# EAGLE board BMSV1.1 (EAGLE 9.2.2), part 1 of 2
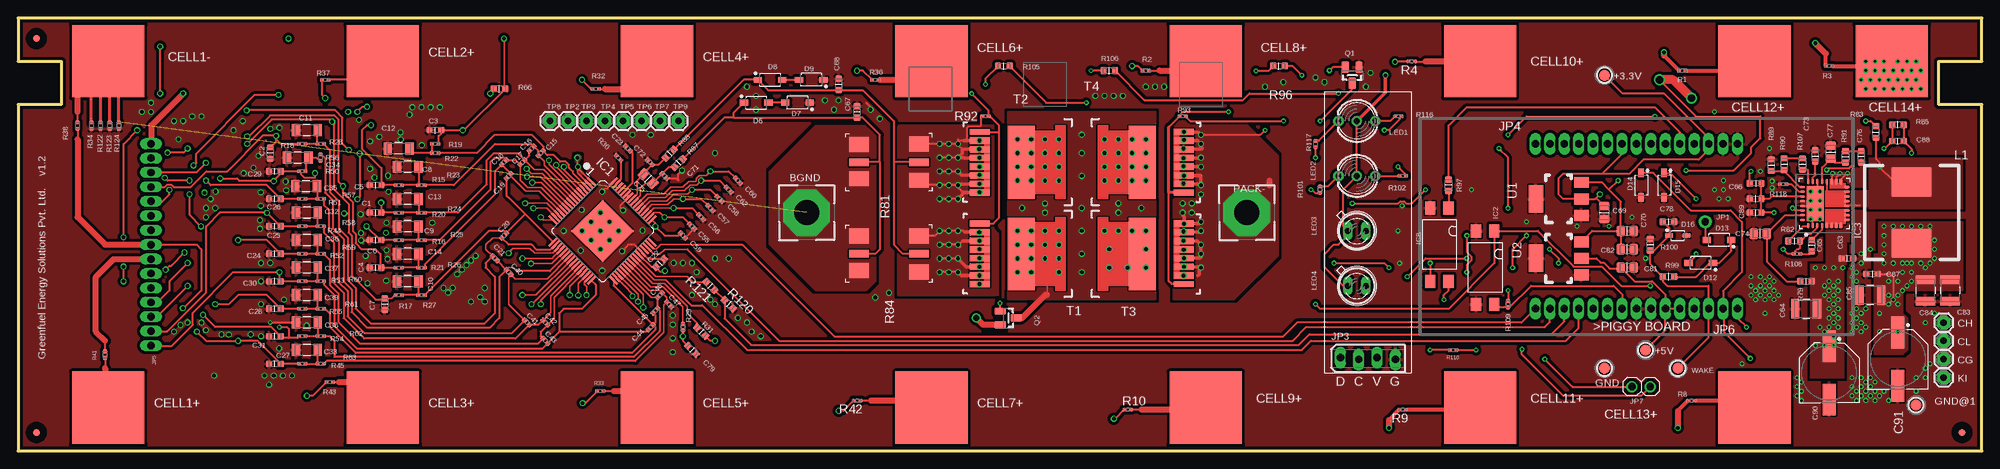
[diagram p3: board, top side]
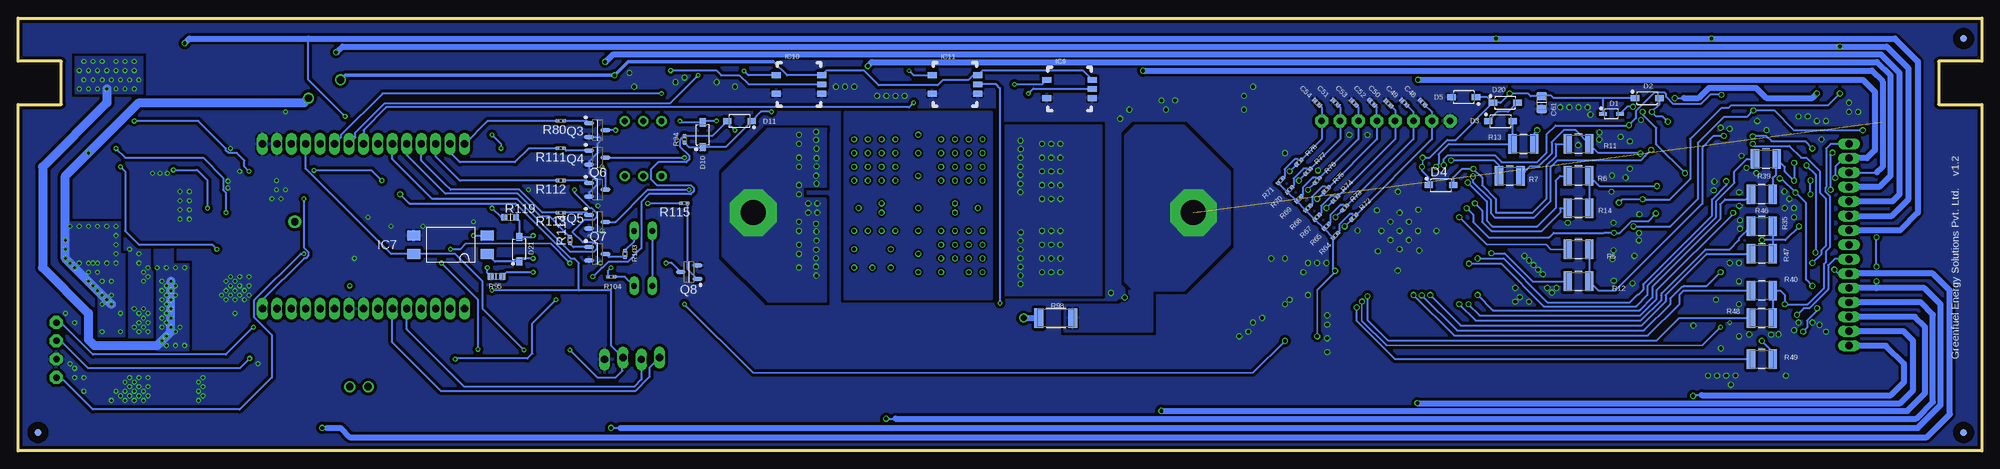
[diagram p4: board, bottom side, seen from below]

Size 272 x 60 mm. Coordinates in mm from the lower left corner, seen from the top.
Outline: 0,0 272,0 272,48 266,48 266,54 272,54 272,60 0,60 0,54 6,54 6,48 0,48 0,0
Copper layers (1*16): Top 0.035mm / dielectric 1.5mm / Bottom 0.035mm
Design rules "SeeedStudio_2layer_DRU_no_angle_20140221 *": minimum track width 6mil, minimum drill 12mil, track to track 10mil, track to pad 8mil, pad to pad 6mil, via to via 10mil, smd to smd 0mil, copper to edge 10mil, drill to drill 10mil, minimum pad ring 10mil, minimum via ring 6mil, stop-mask expansion 2mil, vias tented up to drill 100mil, thermal gap 10mil

## Footprints (pad centres in the part's own frame; a part is rotated, then mirrored left to right if it is on the bottom)
TP-SMD60 = smd 1.524 x 1.524: P$1 0,0
WPAD = drill 3.5 pad 6.452 octagon: 1 0,0
CAPC1608X92N = smd 0.9 x 0.95: 1 -0.8,0; 2 0.8,0
CAPC3215X168N = smd 1.15 x 1.65: 1 -1.5,0; 2 1.5,0
CAPC1005X60N = smd 0.65 x 0.65: 1 -0.45,0; 2 0.45,0
CAPC2012X145AN = smd 1.15 x 1.45: 1 -0.9,0; 2 0.9,0
CAPC3225X168N = smd 1.15 x 2.7: 1 -1.5,0; 2 1.5,0
CAPAE830X1020N = smd 4.4 x 1.8: + -3.7,0; - 3.7,0
CELL_PAD = smd 10 x 10: P$1 0,0
TP7035 = drill 0.9 pad 1.778 octagon: P$1 0,0
SOD2514X100N = smd 1.05 x 0.5: A 1.2,0; K -1.2,0
SOD3718X135N = smd 1.15 x 0.8: A 1.7,0; K -1.7,0
FIDUCIAL_1MM = smd 1 x 1: 1 0,0
64PIN-LQFP = smd 1.55 x 0.3: 1 -5.93,3.75; 2 -5.93,3.25; 3 -5.93,2.75; 4 -5.93,2.25; 5 -5.93,1.75; 6 -5.93,1.25; 7 -5.93,0.75; 8 -5.93,0.25; 9 -5.93,-0.25; 10 -5.93,-0.75; 11 -5.93,-1.25; 12 -5.93,-1.75; 13 -5.93,-2.25; 14 -5.93,-2.75; 15 -5.93,-3.25; 16 -5.93,-3.75; 33 5.93,-3.75; 34 5.93,-3.25; 35 5.93,-2.75; 36 5.93,-2.25; 37 5.93,-1.75; 38 5.93,-1.25; 39 5.93,-0.75; 40 5.93,-0.25; 41 5.93,0.25; 42 5.93,0.75; 43 5.93,1.25; 44 5.93,1.75; 45 5.93,2.25; 46 5.93,2.75; 47 5.93,3.25; 48 5.93,3.75 | smd 0.3 x 1.55: 17 -3.75,-5.93; 18 -3.25,-5.93; 19 -2.75,-5.93; 20 -2.25,-5.93; 21 -1.75,-5.93; 22 -1.25,-5.93; 23 -0.75,-5.93; 24 -0.25,-5.93; 25 0.25,-5.93; 26 0.75,-5.93; 27 1.25,-5.93; 28 1.75,-5.93; 29 2.25,-5.93; 30 2.75,-5.93; 31 3.25,-5.93; 32 3.75,-5.93; 49 3.75,5.93; 50 3.25,5.93; 51 2.75,5.93; 52 2.25,5.93; 53 1.75,5.93; 54 1.25,5.93; 55 0.75,5.963; 56 0.25,5.93; 57 -0.25,5.93; 58 -0.75,5.93; 59 -1.25,5.93; 60 -1.75,5.93; 61 -2.25,5.93; 62 -2.75,5.93; 63 -3.25,5.93; 64 -3.75,5.93 | smd 6.1 x 6.1: 65 0,0
SFH = smd 1.4 x 1.8: 1 1.27,5.08; 2 -1.27,5.08; 3 -1.27,-5.08; 4 1.27,-5.08
VQFN-32 = smd 0.75 x 0.35: 1 -3.05,2.275; 2 -3.05,1.625; 3 -3.05,0.975; 4 -3.05,0.325; 5 -3.05,-0.325; 6 -3.05,-0.975; 7 -3.05,-1.625; 8 -3.05,-2.275; 17 3.05,-2.275; 18 3.05,-1.625; 19 3.05,-0.975; 20 3.05,-0.325; 21 3.05,0.325; 22 3.05,0.975; 23 3.05,1.625; 24 3.05,2.275 | smd 0.35 x 0.75: 9 -2.275,-3.05; 10 -1.625,-3.05; 11 -0.975,-3.05; 12 -0.325,-3.05; 13 0.325,-3.05; 14 0.975,-3.05; 15 1.625,-3.05; 16 2.275,-3.05; 25 2.275,3.05; 26 1.625,3.05; 27 0.975,3.05; 28 0.325,3.05; 29 -0.325,3.05; 30 -0.975,3.05; 31 -1.625,3.05; 32 -2.275,3.05 | smd 4.85 x 2.36: 33 0,1.27
SO6-5PIN = smd 0.8 x 1.2: 1 -1.27,-3.15; 3 1.27,-3.15; 4 1.27,3.15; 5 0,3.15; 6 -1.27,3.15
1X01-CLEANBIG = drill 1.016 pad 1.778: 1 0,0
OLED-CON = drill 1.016 long: 1 0,0.127; 2 2.54,-0.127; 3 5.08,0.127; 4 7.62,-0.127
1X15 = drill 1.016 long: 1 -14,0; 2 -12,0; 3 -10,0; 4 -8,0; 5 -6,0; 6 -4,0; 7 -2,0; 8 0,0; 9 2,0; 10 4,0; 11 6,0; 12 8,0; 13 10,0; 14 12,0; 15 14,0
1X02 = drill 1.016: 1 -2.54,0; 2 0,0
MSS1278D/T = smd 5.5 x 4: 1 0,4.25; 2 0,-4.25
L-59EGW-CA = drill 0.8 pad 1.4: 1 0,2.54; 2 0,0; 3 0,-2.54
SFH482 = drill 0.813 long: A -1.27,0; K 1.27,0
SOT23-3 = smd 1 x 1.6: 1 -0.95,-1.1; 2 0.95,-1.1; 3 0,1.1
SOT95P280X135-3N = smd 1.4 x 0.65: 1 -1.15,0.95; 2 -1.15,-0.95; 3 1.15,0
RESC1005X40AN = smd 0.6 x 0.6: 1 -0.45,0; 2 0.45,0
RESC3225X70N = smd 1.15 x 2.7: 1 -1.5,0; 2 1.5,0
RESC1608X55N = smd 0.9 x 1: 1 -0.8,0; 2 0.8,0
SMD4 = smd 2.7 x 2.066: 1 -4.15,2.5; 3 -4.15,-2.5; 4 4.15,-2.45; 6 4.15,2.3 | smd 2.7 x 1.033: 2 -4.15,0; 5 4.15,0
RESC5025X70N = smd 1.25 x 2.7: 1 -2.35,0; 2 2.35,0
PG-HSOF-9 = smd 0.8 x 2.8: 1 -4.2,-5.25; 2 -3,-5.25; 3 -1.8,-5.25; 4 -0.6,-5.25; 5 0.6,-5.25; 6 1.8,-5.25; 7 3,-5.25; 8 4.2,-5.25 | smd 10 x 3.7: 9 0,0.5
SOT-223 = smd 1.5 x 2: 1 -2.3,-3.15; 2 0,-3.15; 3 2.3,-3.15 | smd 3.8 x 2: 4 0,3.15

## Placement (x,y rotation side)
+3.3V  TP-SMD60  [TP-SMD60]  219.71,52.07 0 top
+5V  TP-SMD60  [TP-SMD60]  225.43,13.97 0 top
BGND  [WPAD]  109.22,33.02 0 top
C1  0.047uF  [CAPC1608X92N]  49.53,33.02 180 top
C2  0.047uF  [CAPC1608X92N]  34.92,41.27 270 top
C3  0.047uF  [CAPC1608X92N]  57.79,44.45 180 top
C4  0.047uF  [CAPC1608X92N]  49.53,25.4 180 top
C5  0.047uF  [CAPC1608X92N]  49.53,36.83 180 top
C6  0.047uF  [CAPC1608X92N]  49.53,29.21 180 top
C7  0.047uF  [CAPC1608X92N]  50.8,20.32 270 top
C8  0.47uF  [CAPC3215X168N]  53.98,39.37 180 top
C9  0.47uF  [CAPC3215X168N]  53.98,31.11 180 top
C10  0.47uF  [CAPC3215X168N]  53.98,23.5 180 top
C11  0.47uF  [CAPC3215X168N]  40,44.45 180 top
C12  0.47uF  [CAPC3215X168N]  52.71,41.91 180 top
C13  0.47uF  [CAPC3215X168N]  53.97,34.91 180 top
C14  0.47uF  [CAPC3215X168N]  53.98,27.3 180 top
C15  0.047uF  [CAPC1005X60N]  72.39,41.27 225 top
C16  0.047uF  [CAPC1005X60N]  71.12,41.91 225 top
C17  0.047uF  [CAPC1005X60N]  69.85,40.01 225 top
C18  0.047uF  [CAPC1005X60N]  67.31,40.01 225 top
C19  0.047uF  [CAPC1005X60N]  67.94,38.1 225 top
C20  0.047uF  [CAPC1005X60N]  67.31,29.84 225 top
C21  0.047uF  [CAPC1005X60N]  66.04,26.67 315 top
C22  2.2uF  [CAPC1608X92N]  88.9,26.03 45 top
C23  .047uF  [CAPC1005X60N]  84.45,41.91 135 top
C24  0.047uF  [CAPC1608X92N]  35.56,27.3 180 top
C25  0.047uF  [CAPC1608X92N]  35.56,31.11 180 top
C26  0.047uF  [CAPC1608X92N]  35.56,34.93 180 top
C27  0.047uF  [CAPC1608X92N]  35.56,12.06 180 top
C28  0.047uF  [CAPC1608X92N]  35.56,19.69 180 top
C29  0.047uF  [CAPC1608X92N]  35.56,38.73 180 top
C30  0.047uF  [CAPC1608X92N]  35.56,23.48 180 top
C31  0.047uF  [CAPC1608X92N]  35.56,15.88 180 top
C32  0.47uF  [CAPC3215X168N]  40.01,33.02 180 top
C33  0.47uF  [CAPC3215X168N]  40.01,13.97 180 top
C34  0.47uF  [CAPC3215X168N]  38.73,40.64 180 top
C35  0.47uF  [CAPC3215X168N]  39.89,36.68 180 top
C36  0.47uF  [CAPC3215X168N]  40.01,29.2 180 top
C37  0.47uF  [CAPC3215X168N]  40.01,25.4 180 top
C38  0.47uF  [CAPC3215X168N]  40.01,17.78 180 top
C39  0.47uF  [CAPC3215X168N]  39.99,21.6 180 top
C40  0.047uF  [CAPC1005X60N]  67.94,24.77 315 top
C41  0.047uF  [CAPC1005X60N]  70.48,17.78 315 top
C42  0.047uF  [CAPC1005X60N]  73.03,17.78 315 top
C43  0.047uF  [CAPC1005X60N]  73.03,15.24 315 top
C44  0.047uF  [CAPC1005X60N]  87.63,17.14 45 top
C45  0.047uF  [CAPC1005X60N]  88.27,19.43 45 top
C46  0.047uF  [CAPC1005X60N]  88.9,21.59 45 top
C47  0.047uF  [CAPC1005X60N]  90.17,20.32 315 top
C48  2200pF  [CAPC1005X60N]  77.47,48.26 135 bottom
C49  2200pF  [CAPC1005X60N]  80.01,48.26 135 bottom
C50  2200pF  [CAPC1005X60N]  82.2,48.15 135 bottom
C51  2200pF  [CAPC1005X60N]  89.53,48.26 135 bottom
C52  2200pF  [CAPC1005X60N]  84.46,48.26 135 bottom
C53  2200pF  [CAPC1005X60N]  87,48.26 135 bottom
C54  2200pF  [CAPC1005X60N]  92.08,48.26 135 bottom
C55  1000pF  [CAPC1005X60N]  93.34,31.11 315 top
C56  1000pF  [CAPC1005X60N]  94.61,32.38 315 top
C57  1000pF  [CAPC1005X60N]  95.89,33.66 315 top
C58  1000pF  [CAPC1005X60N]  97.16,34.92 315 top
C59  1000pF  [CAPC1005X60N]  92.08,29.84 315 top
C60  1000pF  [CAPC1005X60N]  99.69,37.47 315 top
C61  0.22uF  [CAPC2012X145AN]  60.96,48.26 270 bottom
C62  1000pF  [CAPC1005X60N]  98.42,36.2 315 top
C63  0.1uF 100V  [CAPC1608X92N]  253.37,26.67 180 top
C64  2.2uF 100V  [CAPC3225X168N]  247.65,19.68 0 top
C65  0.1uF 100V  [CAPC1608X92N]  248.41,28.45 270 top
C66  0.1uF 100V  [CAPC1608X92N]  240.67,37.08 0 top
C67  47nF  [CAPC1608X92N]  116.2,46.99 90 top
C68  47nF  [CAPC1608X92N]  113.67,50.8 90 top
C69  10uF  [CAPC2012X145AN]  219.71,33.02 90 top
C70  10uF  [CAPC2012X145AN]  222.88,30.48 180 top
C71  47nF  [CAPC1005X60N]  89.53,38.1 315 top
C72  47nF  [CAPC1005X60N]  87.5,40.01 135 top
C73  2.2uF 16V  [CAPC1608X92N]  248.92,40.89 90 top
C74  1uF 100V  [CAPC2012X145AN]  241.31,30.1 180 top
C75  6.8uF  [CAPC2012X145AN]  87.27,37.73 135 top
C76  2.2uF  [CAPC1608X92N]  255.28,40.76 270 top
C77  4.7uF  [CAPC2012X145AN]  251.08,41.41 90 top
C78  0.1uF  [CAPC1608X92N]  228.6,31.75 180 top
C79  0.1uF  [CAPC1608X92N]  93.34,13.97 315 top
C81  10uF  [CAPC2012X145AN]  222.88,25.4 180 top
C82  10uF  [CAPC2012X145AN]  222.88,27.94 180 top
C83  47uF 16V  [CAPC3225X168N]  267.59,22.23 270 top
C84  47uF 16V  [CAPC3225X168N]  264.16,22.23 270 top
C85  47uF 16V  [CAPC3225X168N]  256.54,21.59 180 top
C87  0.1uF 16V  [CAPC1608X92N]  256.79,24.51 0 top
C88  4700pF 50V  [CAPC1608X92N]  260.35,42.93 180 top
C89  10pF 50V  [CAPC1608X92N]  240.66,33.02 180 top
C90  39uF 100V  [CAPAE830X1020N]  250.82,10.79 270 top
C91  330uF 25V  [CAPAE830X1020N]  260.35,12.7 270 top
CELL1+  GF_BMS_CELL_PADP_PAD  [CELL_PAD]  12.5,6 0 top
CELL1-  GF_BMS_CELL_PADP_PAD  [CELL_PAD]  12.5,54 0 top
CELL2+  GF_BMS_CELL_PADP_PAD  [CELL_PAD]  50.5,54 0 top
CELL3+  GF_BMS_CELL_PADP_PAD  [CELL_PAD]  50.5,6 0 top
CELL4+  GF_BMS_CELL_PADP_PAD  [CELL_PAD]  88.5,54 0 top
CELL5+  GF_BMS_CELL_PADP_PAD  [CELL_PAD]  88.5,6 0 top
CELL6+  GF_BMS_CELL_PADP_PAD  [CELL_PAD]  126.5,54 0 top
CELL7+  GF_BMS_CELL_PADP_PAD  [CELL_PAD]  126.5,6 0 top
CELL8+  GF_BMS_CELL_PADP_PAD  [CELL_PAD]  164.5,54 0 top
CELL9+  GF_BMS_CELL_PADP_PAD  [CELL_PAD]  164.5,6 0 top
CELL10+  GF_BMS_CELL_PADP_PAD  [CELL_PAD]  202.5,54 0 top
CELL11+  GF_BMS_CELL_PADP_PAD  [CELL_PAD]  202.5,6 0 top
CELL12+  GF_BMS_CELL_PADP_PAD  [CELL_PAD]  240.5,54 0 top
CELL13+  GF_BMS_CELL_PADP_PAD  [CELL_PAD]  240.5,6 0 top
CELL14+  GF_BMS_CELL_PADP_PAD  [CELL_PAD]  259.5,54 0 top
CG  TPTH7035  [TP7035]  266.7,12.7 0 top
CH  TPTH7035  [TP7035]  266.7,17.78 0 top
CL  TPTH7035  [TP7035]  266.7,15.24 0 top
D1  43V  [SOD2514X100N]  51.31,46.74 0 bottom
D2  33V  [SOD3718X135N]  46.35,48.9 0 bottom
D3  8.2V  [SOD3718X135N]  66.67,45.72 0 bottom
D4  20V  [SOD3718X135N]  74.93,36.83 0 bottom
D5  75V  [SOD3718X135N]  71.75,49.02 180 bottom
D6  2v  [SOD3718X135N]  102.22,48.26 0 top
D7  2v  [SOD3718X135N]  107.95,48.26 180 top
D8  2v  [SOD3718X135N]  104.14,51.44 0 top
D9  2v  [SOD3718X135N]  109.86,51.44 180 top
D10  [SOD3718X135N]  177.16,43.81 90 bottom
D11  8.2v  [SOD3718X135N]  172.09,45.72 180 bottom
D12  [SOD3718X135N]  233.04,26.04 180 top
D13  [SOD3718X135N]  235.59,29.21 180 top
D14  [SOD3718X135N]  224.79,36.83 270 top
D15  [SOD3718X135N]  227.97,36.83 270 top
D16  [SOD2514X100N]  229.87,29.84 0 top
D20  8.2V  [SOD3718X135N]  66.04,48.26 0 bottom
D21  8.2V  [SOD3718X135N]  202.56,27.94 90 bottom
FD1  FIDUCIAL  [FIDUCIAL_1MM]  2.54,2.54 0 top
FD2  FIDUCIAL  [FIDUCIAL_1MM]  269.24,2.54 0 top
FD3  FIDUCIAL  [FIDUCIAL_1MM]  2.54,57.15 0 top
FD4  FIDUCIAL  [FIDUCIAL_1MM]  2.54,57.15 0 bottom
FD5  FIDUCIAL  [FIDUCIAL_1MM]  269.24,2.54 0 bottom
FD6  FIDUCIAL  [FIDUCIAL_1MM]  2.54,2.54 0 bottom
GND  TP-SMD60  [TP-SMD60]  219.71,11.43 0 top
GND@1  TP-SMD60  [TP-SMD60]  262.89,6.35 0 top
IC1  MC33771BEP  [64PIN-LQFP]  80.95,30.48 315 top
IC2  SFH6156-1  [SFH]  203.2,25.4 0 top
IC3  MIC28515V1  [VQFN-32]  250.19,34.29 90 top
IC7  SFH6156-1  [SFH]  212.09,28.57 270 bottom
IC8  SFH6156-1  [SFH]  196.85,28.57 0 top
IC9  TLP152-COUPLERTOSHIBA  [SO6-5PIN]  126.36,50.16 270 bottom
IC10  TLP152-COUPLERTOSHIBA  [SO6-5PIN]  163.83,50.8 270 bottom
IC11  TLP152-COUPLERTOSHIBA  [SO6-5PIN]  142.24,50.8 270 bottom
JP1  [1X01-CLEANBIG]  233.68,31.75 0 top
JP3  [OLED-CON]  183.14,12.8 0 top
JP4  [1X15]  224.16,42.55 0 top
JP5  [1X15]  18.41,28.57 90 top
JP6  [1X15]  224.16,19.68 0 top
JP7  [1X02]  226.06,8.89 0 top
KI  TPTH7035  [TP7035]  266.7,10.16 0 top
L1  MSS1278-D  [MSS1278D/T]  262.25,33.02 0 top
LED1  L-59EGW-CAGR  [L-59EGW-CA]  185.42,45.72 90 top
LED2  L-59EGW-CAGR  [L-59EGW-CA]  185.42,38.1 90 top
LED3  SFH48225  [SFH482]  185.42,30.48 0 top
LED4  SFH48225  [SFH482]  185.42,22.86 0 top
PACK-  [WPAD]  170.18,33.02 0 top
Q1  ZXMP10A17G  [SOT23-3]  184.78,52.07 180 top
Q2  SI2392ADS-T1-GE3  [SOT23-3]  137.16,18.41 270 top
Q3  [SOT95P280X135-3N]  191.77,44.45 0 bottom
Q4  [SOT95P280X135-3N]  191.77,40.64 0 bottom
Q5  [SOT95P280X135-3N]  191.77,31.75 0 bottom
Q6  [SOT95P280X135-3N]  191.77,36.2 0 bottom
Q7  [SOT95P280X135-3N]  191.77,27.3 0 bottom
Q8  [SOT95P280X135-3N]  179.07,24.77 180 bottom
R1  0E  [RESC1005X40AN]  230.5,52.7 180 top
R2  0E  [RESC1005X40AN]  156.21,52.7 180 top
R3  0E  [RESC1005X40AN]  250.82,53.34 180 top
R4  0E  [RESC1005X40AN]  193.04,53.98 180 top
R5  39E  [RESC3225X70N]  55.88,27.94 180 bottom
R6  39E  [RESC3225X70N]  55.88,38.1 180 bottom
R7  39E  [RESC3225X70N]  65.41,38.1 180 bottom
R8  0E  [RESC1005X40AN]  231.78,6.99 180 top
R9  0E  [RESC1005X40AN]  191.77,5.71 180 top
R10  0E  [RESC1005X40AN]  153.67,5.71 0 top
R11  39E  [RESC3225X70N]  55.88,42.55 180 bottom
R12  39E  [RESC3225X70N]  55.88,23.5 180 bottom
R13  39E  [RESC3225X70N]  63.5,42.55 0 bottom
R14  39E  [RESC3225X70N]  55.88,33.66 180 bottom
R15  3k  [RESC1005X40AN]  52.71,36.83 0 top
R16  3k  [RESC1005X40AN]  52.7,29.21 0 top
R17  3k  [RESC1005X40AN]  52.7,21.59 0 top
R18  3k  [RESC1005X40AN]  39.37,42.55 0 top
R19  3k  [RESC1005X40AN]  57.79,42.55 180 top
R20  3k  [RESC1005X40AN]  52.7,33.01 0 top
R21  3k  [RESC1005X40AN]  52.7,25.4 0 top
R22  2k  [RESC1005X40AN]  57.78,41.27 0 top
R23  2k  [RESC1005X40AN]  55.88,36.83 0 top
R24  2k  [RESC1005X40AN]  55.88,33.02 0 top
R25  2k  [RESC1005X40AN]  55.88,29.21 0 top
R26  2k  [RESC1005X40AN]  55.88,25.4 0 top
R27  2k  [RESC1005X40AN]  55.88,21.59 0 top
R28  2k  [RESC1005X40AN]  41.91,42.55 0 top
R29  10k  [RESC1005X40AN]  92.08,17.14 270 top
R30  10k  [RESC1005X40AN]  83.19,40.64 135 top
R31  127E  [RESC1608X55N]  94.61,16.51 315 top
R32  0E  [RESC1005X40AN]  80.01,50.16 180 top
R33  0E  [RESC1005X40AN]  80.64,8.26 180 top
R34  0E  [RESC1005X40AN]  10.16,45.09 270 top
R35  39E  [RESC3225X70N]  30.48,31.11 180 bottom
R36  0E  [RESC1005X40AN]  118.75,51.44 180 top
R37  0E  [RESC1005X40AN]  42.55,51.44 180 top
R38  0E  [RESC1005X40AN]  8.26,45.09 270 top
R39  39E  [RESC3225X70N]  29.92,40.46 180 bottom
R40  39E  [RESC3225X70N]  30.48,22.23 180 bottom
R41  0E  [RESC1005X40AN]  12.06,13.34 90 top
R42  0E  [RESC1005X40AN]  116.2,6.99 180 top
R43  0E  [RESC1005X40AN]  43.18,9.53 180 top
R44  3k  [RESC1005X40AN]  39.37,31.11 0 top
R45  3k  [RESC1005X40AN]  39.37,12.06 0 top
R46  39E  [RESC3225X70N]  30.48,35.56 180 bottom
R47  39E  [RESC3225X70N]  30.48,27.3 180 bottom
R48  39E  [RESC3225X70N]  30.48,18.41 180 bottom
R49  39E  [RESC3225X70N]  30.48,12.7 180 bottom
R50  3k  [RESC1005X40AN]  39.37,38.73 0 top
R51  3k  [RESC1005X40AN]  39.37,34.93 0 top
R52  3k  [RESC1005X40AN]  39.37,27.3 0 top
R53  3k  [RESC1005X40AN]  39.37,23.5 0 top
R54  3k  [RESC1005X40AN]  39.37,15.88 0 top
R55  3k  [RESC1005X40AN]  39.37,19.68 0 top
R56  2k  [RESC1005X40AN]  41.91,40.64 90 top
R57  2k  [RESC1005X40AN]  41.91,34.92 0 top
R58  2k  [RESC1005X40AN]  41.91,31.11 0 top
R59  2k  [RESC1005X40AN]  41.91,27.3 0 top
R60  2k  [RESC1005X40AN]  41.91,23.5 0 top
R61  2k  [RESC1005X40AN]  41.91,19.68 0 top
R62  2k  [RESC1005X40AN]  41.91,15.88 0 top
R63  2k  [RESC1005X40AN]  41.91,12.06 0 top
R64  10k  [RESC1005X40AN]  89.53,29.84 225 bottom
R65  10k  [RESC1005X40AN]  90.81,31.11 225 bottom
R66  10R  [RESC1608X55N]  66.67,50.16 180 top
R67  10k  [RESC1005X40AN]  92.08,32.38 225 bottom
R68  10k  [RESC1005X40AN]  93.34,33.66 225 bottom
R69  10k  [RESC1005X40AN]  94.61,34.92 225 bottom
R70  10k  [RESC1005X40AN]  95.89,36.2 225 bottom
R71  10k  [RESC1005X40AN]  97.16,37.47 225 bottom
R72  1k  [RESC1005X40AN]  87,32.38 45 bottom
R73  1k  [RESC1005X40AN]  88.27,33.66 45 bottom
R74  1k  [RESC1005X40AN]  89.53,34.92 45 bottom
R75  1k  [RESC1005X40AN]  90.81,36.2 45 bottom
R76  1k  [RESC1005X40AN]  92.08,37.47 45 bottom
R77  1k  [RESC1005X40AN]  93.34,38.73 45 bottom
R78  1k  [RESC1005X40AN]  94.61,40.01 45 bottom
R79  2.2E  [RESC1608X55N]  247.65,23.5 180 top
R80  1K  [RESC1005X40AN]  196.85,45.72 180 bottom
R81  LRMAP3920SUNT  [SMD4]  120.65,40.01 180 top
R82  1.6k  [RESC1608X55N]  246,29.08 0 top
R83  16.2k  [RESC1608X55N]  257.3,44.19 90 top
R84  LRMAP3920SUNT  [SMD4]  120.65,27.3 180 top
R85  10k  [RESC1608X55N]  260.35,45.21 180 top
R86  526E  [RESC1608X55N]  240.66,34.92 180 top
R87  127E  [RESC1608X55N]  91.5,39.91 225 top
R88  127E  [RESC1608X55N]  90.25,41.2 225 top
R89  100k  [RESC1608X55N]  242.82,39.62 90 top
R90  200k  [RESC1608X55N]  244.6,39.75 90 top
R91  1R  [RESC1608X55N]  253.11,40.77 90 top
R92  10k  [RESC1005X40AN]  133.99,46.35 0 top
R93  10k  [RESC1005X40AN]  161.29,46.35 0 top
R94  10k  [RESC1005X40AN]  179.69,43.18 270 bottom
R95  127E  [RESC1608X55N]  205.74,24.16 180 bottom
R96  127E  [RESC1608X55N]  174.62,53.34 180 top
R97  127E  [RESC1608X55N]  198.12,36.83 270 top
R98  1K  [RESC5025X70N]  128.27,18.41 180 bottom
R99  2.2k  [RESC1608X55N]  228.6,24.13 180 top
R100  56k  [RESC1608X55N]  226.06,28.57 90 top
R101  75E  [RESC1005X40AN]  180.34,36.2 270 top
R102  75E  [RESC1005X40AN]  191.77,38.1 0 top
R103  75E  [RESC1005X40AN]  187.96,27.3 270 bottom
R104  75E  [RESC1005X40AN]  189.87,24.13 180 bottom
R105  127E  [RESC1608X55N]  136.53,53.34 180 top
R106  127E  [RESC1608X55N]  151.13,52.7 180 top
R107  100k  [RESC1608X55N]  247.14,39.75 90 top
R108  0R  [RESC1005X40AN]  246.38,27.3 180 top
R109  10K  [RESC1005X40AN]  206.38,20.32 90 top
R110  10K  [RESC1005X40AN]  198.75,13.97 180 top
R111  1K  [RESC1005X40AN]  196.85,41.91 180 bottom
R112  1K  [RESC1005X40AN]  196.85,37.47 180 bottom
R113  1K  [RESC1005X40AN]  196.85,33.02 180 bottom
R114  1K  [RESC1005X40AN]  195.58,29.21 90 bottom
R115  1K  [RESC1005X40AN]  179.71,34.29 180 bottom
R116  75E  [RESC1005X40AN]  191.13,46.35 0 top
R117  75E  [RESC1005X40AN]  179.71,42.55 270 top
R118  0E  [RESC1005X40AN]  244.47,36.96 180 top
R119  127E  [RESC1608X55N]  203.84,32.38 0 bottom
R120  10k  [RESC1608X55N]  98.42,20.32 315 top
R121  5.23k  [RESC1608X55N]  95.89,22.86 135 top
R122  0E  [RESC1005X40AN]  11.43,45.09 270 top
R123  0E  [RESC1005X40AN]  12.7,45.09 270 top
R124  0E  [RESC1005X40AN]  13.97,45.09 270 top
S1  PGBRD6030-6030  [PIG6030]  224.16,31.11 0 top
T1  IPT020N10N3V1  [PG-HSOF-9]  138.43,27.3 270 top
T2  IPT020N10N3V1  [PG-HSOF-9]  138.43,40.01 270 top
T3  IPT020N10N3V1  [PG-HSOF-9]  156.21,27.3 90 top
T4  IPT020N10N3V1  [PG-HSOF-9]  156.21,40.01 90 top
TP2  TPTH7035  [TP7035]  76.2,45.72 0 top
TP3  TPTH7035  [TP7035]  78.74,45.72 0 top
TP4  TPTH7035  [TP7035]  81.28,45.72 0 top
TP5  TPTH7035  [TP7035]  83.82,45.72 0 top
TP6  TPTH7035  [TP7035]  86.36,45.72 0 top
TP7  TPTH7035  [TP7035]  88.9,45.72 0 top
TP8  TPTH7035  [TP7035]  73.66,45.72 0 top
TP9  TPTH7035  [TP7035]  91.44,45.72 0 top
U1  NCV1117ST33T3G  [SOT-223]  213.36,34.92 90 top
U2  NCV1117ST50T3G  [SOT-223]  213.36,26.67 90 top
WAKE  TP-SMD60  [TP-SMD60]  229.87,11.43 0 top